# EAGLE schematic Daughter Card v6 (EAGLE 8.4.0)
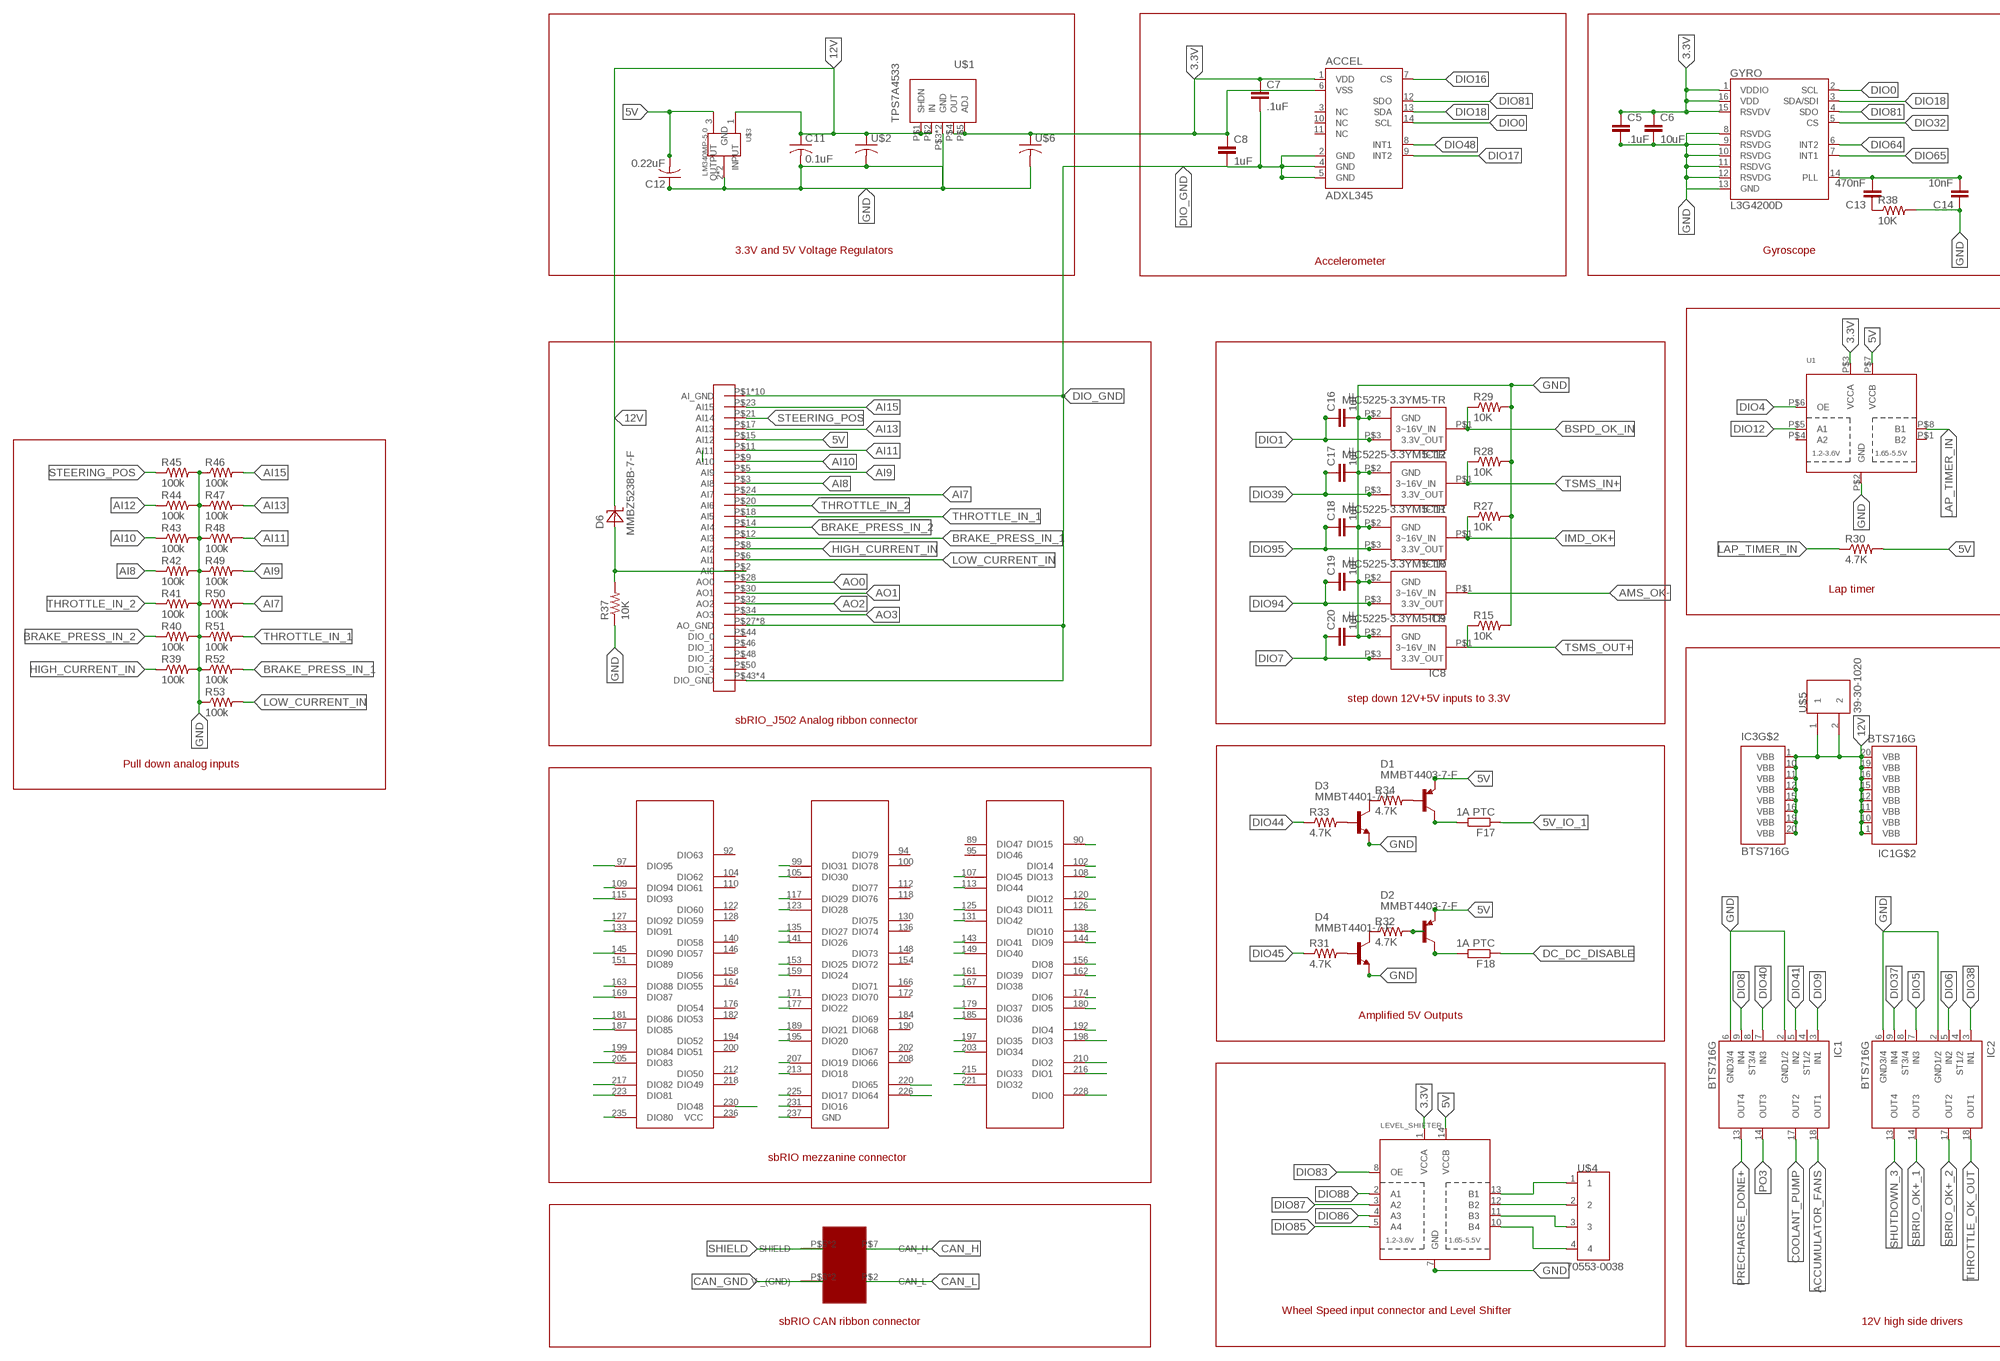
[diagram p0: schematic, sheet 1, part 1 of 2]
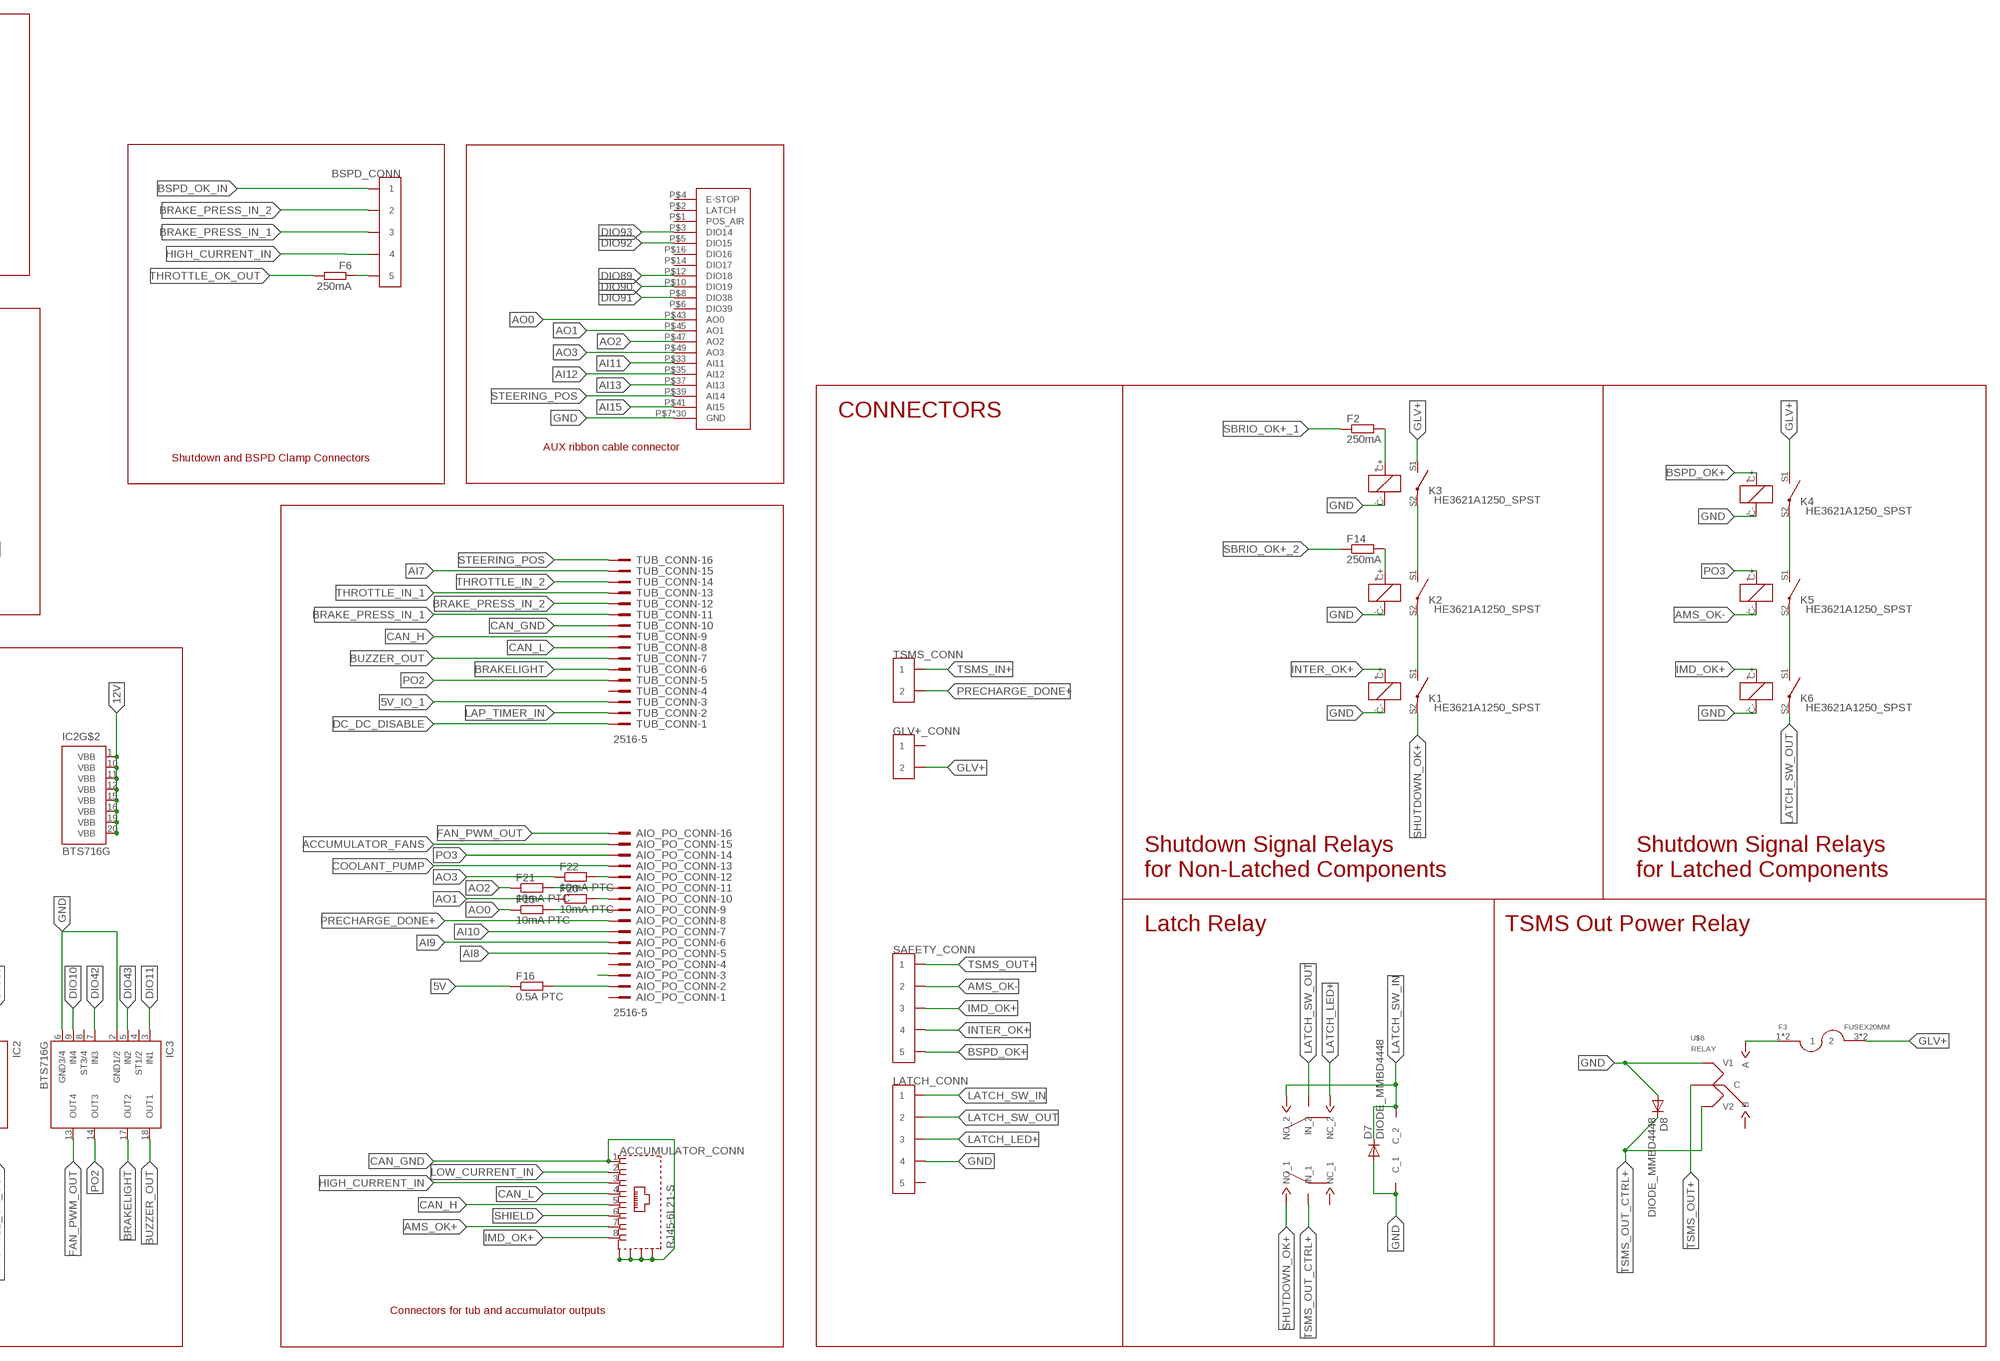
[diagram p1: schematic, sheet 1, part 2 of 2]

## Parts
ACCEL  ADXL345  [LGA14]
ACCUMULATOR_CONN  RJ45-6L21-S  [RJ45-SHIELD1]
AIO_PO_CONN  2516-5  [PAK100/2500-5-16]
BSPD_CONN  CONN_5  [CONNECTOR_5]
C5  .1uF  CAP0603-CAP  [0603-CAP]
C6  10uF  CAP0603-CAP  [0603-CAP]
C7  .1uF  CAP0603-CAP  [0603-CAP]
C8  1uF  CAP0603-CAP  [0603-CAP]
C11  0.1uF  C-USC1206  [C1206]
C12  0.22uF  C-USC1206  [C1206]
C13  470nF  CAP0603-CAP  [0603-CAP]
C14  10nF  CAP0603-CAP  [0603-CAP]
C16  1uF  CAP0603-CAP  [0603-CAP]
C17  1uF  CAP0603-CAP  [0603-CAP]
C18  1uF  CAP0603-CAP  [0603-CAP]
C19  1uF  CAP0603-CAP  [0603-CAP]
C20  1uF  CAP0603-CAP  [0603-CAP]
D1  MMBT4403-7-F  [SOT-23-3]
D2  MMBT4403-7-F  [SOT-23-3]
D3  MMBT4401-7-F  [SOT-23-3]
D4  MMBT4401-7-F  [SOT-23-3]
D6  MMBZ5238B-7-F  [SOT-23-3]
D7  DIODE_MMBD4448  [SOT-23-3]
D8  DIODE_MMBD4448  [SOT-23-3]
F2  250mA  R-EU_R0603  [R0603]
F3  FUSEX20MM  [FUSE_5MM]
F6  250mA  R-EU_R0603  [R0603]
F14  250mA  R-EU_R0603  [R0603]
F15  10mA PTC  R-EU_R0402  [R0402]
F16  0.5A PTC  R-EU_R0603  [R0603]
F17  1A PTC  R-EU_R0603  [R0603]
F18  1A PTC  R-EU_R0603  [R0603]
F20  10mA PTC  R-EU_R0402  [R0402]
F21  10mA PTC  R-EU_R0402  [R0402]
F22  10mA PTC  R-EU_R0402  [R0402]
GLV+_CONN  CONN_2  [CONNECTOR_2]
GYRO  L3G4200D  [LGA16-4X4]
IC1  BTS716G  [PG-DSO-20]
IC2  BTS716G  [PG-DSO-20]
IC3  BTS716G  [PG-DSO-20]
IC8  MIC5225-3.3YM5-TR  [SOT-23-3]
IC9  MIC5225-3.3YM5-TR  [SOT-23-3]
IC10  MIC5225-3.3YM5-TR  [SOT-23-3]
IC11  MIC5225-3.3YM5-TR  [SOT-23-3]
IC12  MIC5225-3.3YM5-TR  [SOT-23-3]
K1  HE3621A1250_SPST  [HE3621A1250_SPST]
K2  HE3621A1250_SPST  [HE3621A1250_SPST]
K3  HE3621A1250_SPST  [HE3621A1250_SPST]
K4  HE3621A1250_SPST  [HE3621A1250_SPST]
K5  HE3621A1250_SPST  [HE3621A1250_SPST]
K6  HE3621A1250_SPST  [HE3621A1250_SPST]
LATCH_CONN  CONN_5  [CONNECTOR_5]
LATCH_U7  JW2SN-DC12V  [DPDT_JW2_FORM_C]
LEVEL_SHIFTER  TXB0104PWR  [TSSOP14]
R15  10K  R-US_R0603  [R0603]
R27  10K  R-US_R0603  [R0603]
R28  10K  R-US_R0603  [R0603]
R29  10K  R-US_R0603  [R0603]
R30  4.7K  R-US_R0603  [R0603]
R31  4.7K  R-US_R0603  [R0603]
R32  4.7K  R-US_R0603  [R0603]
R33  4.7K  R-US_R0603  [R0603]
R34  4.7K  R-US_R0603  [R0603]
R37  10K  R-US_R0603  [R0603]
R38  10K  R-US_R0603  [R0603]
R39  100k  R-US_R0603  [R0603]
R40  100k  R-US_R0603  [R0603]
R41  100k  R-US_R0603  [R0603]
R42  100k  R-US_R0603  [R0603]
R43  100k  R-US_R0603  [R0603]
R44  100k  R-US_R0603  [R0603]
R45  100k  R-US_R0603  [R0603]
R46  100k  R-US_R0603  [R0603]
R47  100k  R-US_R0603  [R0603]
R48  100k  R-US_R0603  [R0603]
R49  100k  R-US_R0603  [R0603]
R50  100k  R-US_R0603  [R0603]
R51  100k  R-US_R0603  [R0603]
R52  100k  R-US_R0603  [R0603]
R53  100k  R-US_R0603  [R0603]
SAFETY_CONN  CONN_5  [CONNECTOR_5]
SBRIO_ANALOG  SBRIO_MIO  [SBRIO_J502_J503]
SBRIO_AUX  SBRIO_AUX  [SBRIO_J502_J503]
SBRIO_CAN  SBRIO_W500  [SBRIO_W]
SBRIO_MEZZANINE  SBRIO_RMC  [SEAM-40-XX.X-XX-06-X-A]
TSMS_CONN  CONN_2  [CONNECTOR_2]
TUB_CONN  2516-5  [PAK100/2500-5-16]
U1  TXS0102  [VFSOP-8]
U$1  TPS7A4533  [TPS7A4533]
U$2  C-USC1206  [C1206]
U$3  LM340MP-5.0  [SOT-223-4]
U$4  70553-0038  [MOLEX_70553-0038]
U$5  39-30-1020  [MOLEX_39-30-1020]
U$6  C-USC1206  [C1206]
U$8  RELAY  [RELAY]

## Nets
3.3V: ACCEL.1(VDD) ACCEL.6(VSS) C5.1 C6.1 C7.1 C8.1 GYRO.1(VDDIO) GYRO.15(RSVDV) GYRO.16(VDD) LEVEL_SHIFTER.1(VCCA) U1.P$3(VCCA) U$1.P$4(OUT) U$1.P$5(ADJ) U$6.1
5V: C12.2 D1.P$3(E) D2.P$3(E) F16.1 LEVEL_SHIFTER.14(VCCB) R30.2 SBRIO_ANALOG.P$15(AI12) U1.P$7(VCCB) U$3.3(OUTPUT)
5V_FUSED: AIO_PO_CONN.2 F16.2
5V_IO_1: F17.1 TUB_CONN.3
12V: C11.1 D6.P$1(C) IC1.1(VBB) IC1.10(VBB) IC1.11(VBB) IC1.12(VBB) IC1.15(VBB) IC1.16(VBB) IC1.19(VBB) IC1.20(VBB) IC2.1(VBB) IC2.10(VBB) IC2.11(VBB) IC2.12(VBB) IC2.15(VBB) IC2.16(VBB) IC2.19(VBB) IC2.20(VBB) IC3.1(VBB) IC3.10(VBB) IC3.11(VBB) IC3.12(VBB) IC3.15(VBB) IC3.16(VBB) IC3.19(VBB) IC3.20(VBB) U$1.P$1(SHDN) U$1.P$2(IN) U$2.1 U$3.1(INPUT) U$5.1 U$5.2
ACCUMULATOR_FANS: AIO_PO_CONN.15 IC1.18(OUT1)
AI7: R50.2 SBRIO_ANALOG.P$24(AI7) TUB_CONN.15
AI8: AIO_PO_CONN.5 R42.1 SBRIO_ANALOG.P$3(AI8)
AI9: AIO_PO_CONN.6 R49.2 SBRIO_ANALOG.P$5(AI9)
AI10: AIO_PO_CONN.7 R43.1 SBRIO_ANALOG.P$9(AI10)
AI11: R48.2 SBRIO_ANALOG.P$11(AI11) SBRIO_AUX.P$33(AI11)
AI12: R44.1 SBRIO_AUX.P$35(AI12)
AI13: R47.2 SBRIO_ANALOG.P$17(AI13) SBRIO_AUX.P$37(AI13)
AI15: R46.2 SBRIO_ANALOG.P$23(AI15) SBRIO_AUX.P$41(AI15)
AMS_OK+: ACCUMULATOR_CONN.7
AMS_OK-: IC9.P$1(3~16V_IN) K5.C- SAFETY_CONN.3 SAFETY_CONN.4
AO0: F15.1 SBRIO_ANALOG.P$28(AO0) SBRIO_AUX.P$43(AO0)
AO1: F20.1 SBRIO_ANALOG.P$30(AO1) SBRIO_AUX.P$45(AO1)
AO2: F21.1 SBRIO_ANALOG.P$32(AO2) SBRIO_AUX.P$47(AO2)
AO3: F22.1 SBRIO_ANALOG.P$34(AO3) SBRIO_AUX.P$49(AO3)
BRAKE_PRESS_IN_1: BSPD_CONN.5 BSPD_CONN.6 R52.2 SBRIO_ANALOG.P$12(AI3) TUB_CONN.11
BRAKE_PRESS_IN_2: BSPD_CONN.3 BSPD_CONN.4 R40.1 SBRIO_ANALOG.P$14(AI4) TUB_CONN.12
BRAKELIGHT: IC3.17(OUT2) TUB_CONN.6
BSPD_OK+: K4.C+ SAFETY_CONN.9 SAFETY_CONN.10
BSPD_OK_IN: BSPD_CONN.1 BSPD_CONN.2 IC12.P$1(3~16V_IN) R29.1
BUZZER_OUT: IC3.18(OUT1) TUB_CONN.7
CAN_GND: ACCUMULATOR_CONN.1 ACCUMULATOR_CONN.S1(S) ACCUMULATOR_CONN.S2(S) ACCUMULATOR_CONN.S3(S) ACCUMULATOR_CONN.S4(S) SBRIO_CAN.P$3(V-_(GND)) SBRIO_CAN.P$6(V-_(GND)) TUB_CONN.10
CAN_H: ACCUMULATOR_CONN.5 SBRIO_CAN.P$7(CAN_H) TUB_CONN.9
CAN_L: ACCUMULATOR_CONN.4 SBRIO_CAN.P$2(CAN_L) TUB_CONN.8
COOLANT_PUMP: AIO_PO_CONN.13 IC1.17(OUT2)
DC_DC_DISABLE: F18.1 TUB_CONN.1
DIO0: ACCEL.14(SCL) GYRO.2(SCL) SBRIO_MEZZANINE.228(DIO0)
DIO1: C16.1 IC12.P$3(3.3V_OUT) SBRIO_MEZZANINE.216(DIO1)
DIO2: SBRIO_MEZZANINE.210(DIO2)
DIO3: SBRIO_MEZZANINE.198(DIO3)
DIO4: SBRIO_MEZZANINE.192(DIO4) U1.P$6(OE)
DIO5: IC2.7(IN3) SBRIO_MEZZANINE.180(DIO5)
DIO6: IC2.5(IN2) SBRIO_MEZZANINE.174(DIO6)
DIO7: C20.1 IC8.P$3(3.3V_OUT) SBRIO_MEZZANINE.162(DIO7)
DIO8: IC1.9(IN4) SBRIO_MEZZANINE.156(DIO8)
DIO9: IC1.3(IN1) SBRIO_MEZZANINE.144(DIO9)
DIO10: IC3.9(IN4) SBRIO_MEZZANINE.138(DIO10)
DIO11: IC3.3(IN1) SBRIO_MEZZANINE.126(DIO11)
DIO12: SBRIO_MEZZANINE.120(DIO12) U1.P$5(A1)
DIO13: SBRIO_MEZZANINE.108(DIO13)
DIO14: SBRIO_MEZZANINE.102(DIO14)
DIO15: SBRIO_MEZZANINE.90(DIO15)
DIO16: ACCEL.7(CS) SBRIO_MEZZANINE.231(DIO16)
DIO17: ACCEL.9(INT2) SBRIO_MEZZANINE.225(DIO17)
DIO18: ACCEL.13(SDA) GYRO.3(SDA/SDI) SBRIO_MEZZANINE.213(DIO18)
DIO19: SBRIO_MEZZANINE.207(DIO19)
DIO20: SBRIO_MEZZANINE.195(DIO20)
DIO21: SBRIO_MEZZANINE.189(DIO21)
DIO22: SBRIO_MEZZANINE.177(DIO22)
DIO23: SBRIO_MEZZANINE.171(DIO23)
DIO24: SBRIO_MEZZANINE.159(DIO24)
DIO25: SBRIO_MEZZANINE.153(DIO25)
DIO26: SBRIO_MEZZANINE.141(DIO26)
DIO27: SBRIO_MEZZANINE.135(DIO27)
DIO28: SBRIO_MEZZANINE.123(DIO28)
DIO29: SBRIO_MEZZANINE.117(DIO29)
DIO30: SBRIO_MEZZANINE.105(DIO30)
DIO31: SBRIO_MEZZANINE.99(DIO31)
DIO32: GYRO.5(CS) SBRIO_MEZZANINE.221(DIO32)
DIO33: SBRIO_MEZZANINE.215(DIO33)
DIO34: SBRIO_MEZZANINE.203(DIO34)
DIO35: SBRIO_MEZZANINE.197(DIO35)
DIO36: SBRIO_MEZZANINE.185(DIO36)
DIO37: IC2.9(IN4) SBRIO_MEZZANINE.179(DIO37)
DIO38: IC2.3(IN1) SBRIO_MEZZANINE.167(DIO38)
DIO39: C17.1 IC11.P$3(3.3V_OUT) SBRIO_MEZZANINE.161(DIO39)
DIO40: IC1.7(IN3) SBRIO_MEZZANINE.149(DIO40)
DIO41: IC1.5(IN2) SBRIO_MEZZANINE.143(DIO41)
DIO42: IC3.7(IN3) SBRIO_MEZZANINE.131(DIO42)
DIO43: IC3.5(IN2) SBRIO_MEZZANINE.125(DIO43)
DIO44: R33.1 SBRIO_MEZZANINE.113(DIO44)
DIO45: R31.1 SBRIO_MEZZANINE.107(DIO45)
DIO48: ACCEL.8(INT1) SBRIO_MEZZANINE.230(DIO48)
DIO64: GYRO.6(INT2) SBRIO_MEZZANINE.226(DIO64)
DIO65: GYRO.7(INT1) SBRIO_MEZZANINE.220(DIO65)
DIO80: SBRIO_MEZZANINE.235(DIO80)
DIO81: ACCEL.12(SDO) GYRO.4(SDO) SBRIO_MEZZANINE.223(DIO81)
DIO82: SBRIO_MEZZANINE.217(DIO82)
DIO83: LEVEL_SHIFTER.8(OE) SBRIO_MEZZANINE.205(DIO83)
DIO84: SBRIO_MEZZANINE.199(DIO84)
DIO85: LEVEL_SHIFTER.5(A4) SBRIO_MEZZANINE.187(DIO85)
DIO86: LEVEL_SHIFTER.4(A3) SBRIO_MEZZANINE.181(DIO86)
DIO87: LEVEL_SHIFTER.3(A2) SBRIO_MEZZANINE.169(DIO87)
DIO88: LEVEL_SHIFTER.2(A1) SBRIO_MEZZANINE.163(DIO88)
DIO89: SBRIO_AUX.P$12(DIO18)
DIO90: SBRIO_AUX.P$10(DIO19) SBRIO_MEZZANINE.145(DIO90)
DIO91: SBRIO_AUX.P$8(DIO38) SBRIO_MEZZANINE.133(DIO91)
DIO92: SBRIO_AUX.P$5(DIO15) SBRIO_MEZZANINE.127(DIO92)
DIO93: SBRIO_AUX.P$3(DIO14) SBRIO_MEZZANINE.115(DIO93)
DIO94: C19.1 IC9.P$3(3.3V_OUT) SBRIO_MEZZANINE.109(DIO94)
DIO95: C18.1 IC10.P$3(3.3V_OUT) SBRIO_MEZZANINE.97(DIO95)
DIO_GND: ACCEL.2(GND) ACCEL.4(GND) ACCEL.5(GND) C7.2 C8.2 SBRIO_ANALOG.P$1(AI_GND) SBRIO_ANALOG.P$4(AI_GND) SBRIO_ANALOG.P$7(AI_GND) SBRIO_ANALOG.P$10(AI_GND) SBRIO_ANALOG.P$13(AI_GND) SBRIO_ANALOG.P$16(AI_GND) SBRIO_ANALOG.P$19(AI_GND) SBRIO_ANALOG.P$22(AI_GND) SBRIO_ANALOG.P$25(AI_GND) SBRIO_ANALOG.P$26(AI_GND) SBRIO_ANALOG.P$27(AO_GND) SBRIO_ANALOG.P$29(AO_GND) SBRIO_ANALOG.P$31(AO_GND) SBRIO_ANALOG.P$33(AO_GND) SBRIO_ANALOG.P$35(AO_GND) SBRIO_ANALOG.P$37(AO_GND) SBRIO_ANALOG.P$39(AO_GND) SBRIO_ANALOG.P$41(AO_GND) SBRIO_ANALOG.P$43(DIO_GND) SBRIO_ANALOG.P$45(DIO_GND) SBRIO_ANALOG.P$47(DIO_GND) SBRIO_ANALOG.P$49(DIO_GND)
FAN_PWM_OUT: AIO_PO_CONN.16 IC3.13(OUT4)
GLV+: F3.3 F3.4 GLV+_CONN.3 GLV+_CONN.4 K3.S1(SW_1) K4.S1(SW_1)
GND: C5.2 C6.2 C11.2 C12.1 C14.1 C16.2 C17.2 C18.2 C19.2 C20.2 D3.P$3(E) D4.P$3(E) D7.P$2(A) D8.P$2(A) GYRO.8(RSVDG) GYRO.9(RSVDG) GYRO.10(RSVDG) GYRO.11(RSDVG) GYRO.12(RSVDG) GYRO.13(GND) IC1.2(GND1/2) IC1.6(GND3/4) IC2.2(GND1/2) IC2.6(GND3/4) IC3.2(GND1/2) IC3.6(GND3/4) IC8.P$2(GND) IC9.P$2(GND) IC10.P$2(GND) IC11.P$2(GND) IC12.P$2(GND) K1.C- K2.C- K3.C- K4.C- K6.C- LATCH_CONN.7 LATCH_CONN.8 LATCH_U7.COIL_1(C_1) LEVEL_SHIFTER.7(GND) R15.2 R27.2 R28.2 R29.2 R37.1 R38.2 R39.2 R40.2 R41.2 R42.2 R43.2 R44.2 R45.2 R46.1 R47.1 R48.1 R49.1 R50.1 R51.1 R52.1 R53.1 SBRIO_AUX.P$7(GND) SBRIO_AUX.P$9(GND) SBRIO_AUX.P$11(GND) SBRIO_AUX.P$13(GND) SBRIO_AUX.P$15(GND) SBRIO_AUX.P$17(GND) SBRIO_AUX.P$18(GND) SBRIO_AUX.P$19(GND) SBRIO_AUX.P$20(GND) SBRIO_AUX.P$21(GND) SBRIO_AUX.P$22(GND) SBRIO_AUX.P$23(GND) SBRIO_AUX.P$24(GND) SBRIO_AUX.P$25(GND) SBRIO_AUX.P$26(GND) SBRIO_AUX.P$27(GND) SBRIO_AUX.P$28(GND) SBRIO_AUX.P$29(GND) SBRIO_AUX.P$30(GND) SBRIO_AUX.P$31(GND) SBRIO_AUX.P$32(GND) SBRIO_AUX.P$34(GND) SBRIO_AUX.P$36(GND) SBRIO_AUX.P$38(GND) SBRIO_AUX.P$40(GND) SBRIO_AUX.P$42(GND) SBRIO_AUX.P$44(GND) SBRIO_AUX.P$46(GND) SBRIO_AUX.P$48(GND) SBRIO_AUX.P$50(GND) SBRIO_MEZZANINE.237(GND) U1.P$2(GND) U$1.P$3(GND) U$1.P$6(GND) U$2.2 U$3.2(GND) U$3.4(GND) U$6.2 U$8.V1
HIGH_CURRENT_IN: ACCUMULATOR_CONN.3 BSPD_CONN.7 BSPD_CONN.8 R39.1 SBRIO_ANALOG.P$8(AI2)
IMD_OK+: ACCUMULATOR_CONN.8 IC10.P$1(3~16V_IN) K6.C+ R27.1 SAFETY_CONN.5 SAFETY_CONN.6
INTER_OK+: K1.C+ SAFETY_CONN.7 SAFETY_CONN.8
K4: K4.S2(SW_2) K5.S1(SW_1)
LAP_TIMER_IN: R30.1 TUB_CONN.2 U1.P$8(B1)
LATCH_LED+: LATCH_CONN.5 LATCH_CONN.6 LATCH_U7.NC_2
LATCH_SW_IN: D7.P$1(C) LATCH_CONN.1 LATCH_CONN.2 LATCH_U7.COIL_2(C_2) LATCH_U7.NO_2
LATCH_SW_OUT: K6.S2(SW_2) LATCH_CONN.3 LATCH_CONN.4 LATCH_U7.CENTER_2(IN_2)
LOW_CURRENT_IN: ACCUMULATOR_CONN.2 R53.2 SBRIO_ANALOG.P$6(AI1)
N$2: K2.S1(SW_1) K3.S2(SW_2)
N$3: AIO_PO_CONN.9 F15.2
N$4: D6.P$2(A) R37.2 SBRIO_ANALOG.P$2(AI0)
N$6: AIO_PO_CONN.10 F20.2
N$7: K1.S1(SW_1) K2.S2(SW_2)
N$9: AIO_PO_CONN.11 F21.2
N$10: AIO_PO_CONN.12 F22.2
N$13: K5.S2(SW_2) K6.S1(SW_1)
N$14: F3.1 F3.2 U$8.A
N$18: D4.P$1(C) R32.1
N$19: D4.P$2(B) R31.2
N$22: D3.P$2(B) R33.2
N$23: D1.P$2(B) R34.2
N$24: D3.P$1(C) R34.1
N$25: C13.1 R38.1
N$29: AIO_PO_CONN.3
N$37: C13.2 C14.2 GYRO.14(PLL)
N$41: BSPD_CONN.9 BSPD_CONN.10 F6.1
N$56: D1.P$1(C) F17.2
N$57: D2.P$1(C) F18.2
N$58: D2.P$2(B) R32.2
PO2: IC3.14(OUT3) TUB_CONN.5
PO3: AIO_PO_CONN.14 IC1.14(OUT3) K5.C+
PRECHARGE_DONE+: AIO_PO_CONN.8 IC1.13(OUT4) TSMS_CONN.3 TSMS_CONN.4
SBRIO_OK+_1: F2.1 IC2.14(OUT3)
SBRIO_OK+_1_RELAY_IN: F2.2 K3.C+
SBRIO_OK+_2: F14.1 IC2.17(OUT2)
SBRIO_OK_2_RELAY: F14.2 K2.C+
SHIELD: ACCUMULATOR_CONN.6 SBRIO_CAN.P$5(SHIELD) SBRIO_CAN.P$10(SHIELD)
SHUTDOWN_3: IC2.13(OUT4)
SHUTDOWN_OK+: K1.S2(SW_2) LATCH_U7.NO_1
STEERING_POS: R45.1 SBRIO_ANALOG.P$21(AI14) SBRIO_AUX.P$39(AI14) TUB_CONN.16
THROTTLE_IN_1: R51.2 SBRIO_ANALOG.P$18(AI5) TUB_CONN.13
THROTTLE_IN_2: R41.1 SBRIO_ANALOG.P$20(AI6) TUB_CONN.14
THROTTLE_OK_OUT: F6.2 IC2.18(OUT1)
TSMS_IN+: IC11.P$1(3~16V_IN) R28.1 TSMS_CONN.1 TSMS_CONN.2
TSMS_OUT+: IC8.P$1(3~16V_IN) R15.1 SAFETY_CONN.1 SAFETY_CONN.2 U$8.CENTER(C)
TSMS_OUT_CTRL+: D8.P$1(C) LATCH_U7.CENTER_1(IN_1) U$8.V2
WS1: LEVEL_SHIFTER.13(B1) U$4.1
WS2: LEVEL_SHIFTER.12(B2) U$4.2
WS3: LEVEL_SHIFTER.11(B3) U$4.3
WS4: LEVEL_SHIFTER.10(B4) U$4.4
Unconnected: ACCEL.3(NC) ACCEL.10(NC) ACCEL.11(NC) AIO_PO_CONN.1 AIO_PO_CONN.4 GLV+_CONN.1 GLV+_CONN.2 IC1.4(ST1/2) IC1.8(ST3/4) IC2.4(ST1/2) IC2.8(ST3/4) IC3.4(ST1/2) IC3.8(ST3/4) LATCH_CONN.9 LATCH_CONN.10 LATCH_U7.NC_1 SBRIO_ANALOG.P$44(DIO_0) SBRIO_ANALOG.P$46(DIO_1) SBRIO_ANALOG.P$48(DIO_2) SBRIO_ANALOG.P$50(DIO_3) SBRIO_AUX.P$1(POS_AIR) SBRIO_AUX.P$2(LATCH) SBRIO_AUX.P$4(E-STOP) SBRIO_AUX.P$6(DIO39) SBRIO_AUX.P$14(DIO17) SBRIO_AUX.P$16(DIO16) SBRIO_MEZZANINE.89(DIO47) SBRIO_MEZZANINE.92(DIO63) SBRIO_MEZZANINE.94(DIO79) SBRIO_MEZZANINE.95(DIO46) SBRIO_MEZZANINE.100(DIO78) SBRIO_MEZZANINE.104(DIO62) SBRIO_MEZZANINE.110(DIO61) SBRIO_MEZZANINE.112(DIO77) SBRIO_MEZZANINE.118(DIO76) SBRIO_MEZZANINE.122(DIO60) SBRIO_MEZZANINE.128(DIO59) SBRIO_MEZZANINE.130(DIO75) SBRIO_MEZZANINE.136(DIO74) SBRIO_MEZZANINE.140(DIO58) SBRIO_MEZZANINE.146(DIO57) SBRIO_MEZZANINE.148(DIO73) SBRIO_MEZZANINE.151(DIO89) SBRIO_MEZZANINE.154(DIO72) SBRIO_MEZZANINE.158(DIO56) SBRIO_MEZZANINE.164(DIO55) SBRIO_MEZZANINE.166(DIO71) SBRIO_MEZZANINE.172(DIO70) SBRIO_MEZZANINE.176(DIO54) SBRIO_MEZZANINE.182(DIO53) SBRIO_MEZZANINE.184(DIO69) SBRIO_MEZZANINE.190(DIO68) SBRIO_MEZZANINE.194(DIO52) SBRIO_MEZZANINE.200(DIO51) SBRIO_MEZZANINE.202(DIO67) SBRIO_MEZZANINE.208(DIO66) SBRIO_MEZZANINE.212(DIO50) SBRIO_MEZZANINE.218(DIO49) TUB_CONN.4 U1.P$1(B2) U1.P$4(A2) U$8.B

## Notes on the sheet
- 3.3V and 5V Voltage Regulators | Gyroscope
- Accelerometer
- CONNECTORS
- AUX ribbon cable connector
- Shutdown and BSPD Clamp Connectors
- Lap timer
- step down 12V+5V inputs to 3.3V
- sbRIO_J502 Analog ribbon connector
- Pull down analog inputs
- Shutdown Signal Relays
  for Non-Latched Components
- Shutdown Signal Relays
  for Latched Components
- Latch Relay | TSMS Out Power Relay
- Amplified 5V Outputs
- sbRIO mezzanine connector
- Wheel Speed input connector and Level Shifter | Connectors for tub and accumulator outputs
- sbRIO CAN ribbon connector | 12V high side drivers

## Power pins joined to a net without a drawn wire
VCC: SBRIO_MEZZANINE.236(VCC)

## Library data of the parts
ACCEL = SparkFun-Sensors:ADXL345: 3-axis SPI/I2C 2/4/8/16g accelerometer
ACCUMULATOR_CONN = con-tycoelectronics:RJ45*2: RJ45 Low Profile Shield Type 2 For all RJ45 L, LC, LCT and X Series Models Source: www.tycoelectronics.com .. ENG_DS_1654001_1099_RJ_L_0507.pdf; OC_FARNELL: unknown; OC_NEWARK: unknown
AIO_PO_CONN TUB_CONN = con-3m:2516-: 3M (TM) Pak 100 4-Wall Header Source: 3M; MPN: D2516-5002-AR; OC_FARNELL: 9838376; OC_NEWARK: 12P7055
BSPD_CONN LATCH_CONN SAFETY_CONN = formula electric:CONN_5
C5-C8 C13 C14 C16-C20 = SparkFun-Passives:CAP: Capacitor Standard 0603 ceramic capacitor, and 0.1" leaded capacitor.
C11 C12 U$2 U$6 = rcl:C-US: CAPACITOR, American symbol
D1 D2 = formula electric:MMBT4403-7-F
D3 D4 = formula electric:MMBT4401-7-F
D6 = formula electric:MMBZ5238B-7-F: Digikey: MMBZ5238B-FDICT-ND
D7 D8 = formula electric:DIODE_MMBD4448
F2 F6 F14-F18 F20-F22 = resistor:R-EU_: RESISTOR, European symbol
F3 = SparkFun-Passives:FUSE
GLV+_CONN TSMS_CONN = formula electric:CONN_2
GYRO = SparkFun-Sensors:L3G4200D: L3G4200D Three-axis, digital output gyroscope The L3G4200D is a low-power three-axis angular rate sensor, has a full scale of ±250/±500/±2000 dps and is capable of measuring rates with a user-selectable bandwidth. It includes a sensing element and an IC interface capable of providing the measured angular rate to the external world through a digital interface (I2C/SPI). Package: 4x4x1.1 LGA-16 (LGA16-4x4.PAC)
IC1-IC3 = infineon:BTS716G: Smart High-Side Power Switch Four Channels: 4 x 140mOhm staus Feedback Source: http://www.infineon.com/dgdl/BTS716G.pdf; OC_FARNELL: unknown; OC_NEWARK: unknown
IC8-IC12 = formula electric:MIC5225-3.3YM5-TR: not the device name DIGIKEY PN: MCP1703T-3302E/CBCT-ND; DIGIKEYPN: MCP1703T-3302E/CBCT-ND
K1-K6 = formula electric:HE3621A1250_SPST
LATCH_U7 = formula electric:JW2SN-DC12V: JW2SN-DC12V, DPDT 5A 12V Coil Relay, Digikey: 255-1117-ND
LEVEL_SHIFTER = SparkFun-DigitalIC:TXB0104PWR: 4-Bit Bi-Directional Level Shifter 1.2V-3.6V (VCCA) to 1.65V-5.5V (VCCB) bi-directional level shifter with auto direction sensing. Max data rate - VCCA 1.8V: 20Mbps (50ns), VCCA 3.3V: 100Mbps (10ns) Digikey: 296-21929-1-ND (TSSOP) IC-11329
R15 R27-R34 R37-R53 = resistor:R-US_: RESISTOR, American symbol
SBRIO_ANALOG = formula electric:SBRIO_MIO
SBRIO_AUX = formula electric:SBRIO_AUX: An output for a lot of the extra pins on the sbRIO.
SBRIO_CAN = formula electric:SBRIO_W500
SBRIO_MEZZANINE = SEAM-40-XX.X-XX-06-X-A:SBRIO_RMC
U1 = adafruit:TXS0102: 2-Bit Bi-Directional Level Shifter (I2C, etc.) Designed for I2C devices and has internal pullups. Not to be confused with TXB010x series. 1.2V-3.6V (VCCA) to 1.65V-5.5V (VCCB) bi-directional level shifter with auto direction sensing. Max data rate - 24Mbps (Push Pull), 2Mbps (Open Drain) Digikey: 296-21931-1-ND
U$1 = Texas Instruments_By_element14_Batch_1:TPS7A4533; DIGIKEY_P-N: 490-12344-1-ND; P-N: GRT21BC81C106ME01L
U$3 = texas:LM340MP-5.0
U$4 = molex:70553-0038
U$5 = molex:39-30-1020
U$8 = formula electric:RELAY: Digikey: PB1321-ND